# EAGLE design ioboard-left (EAGLE 9.6.2)
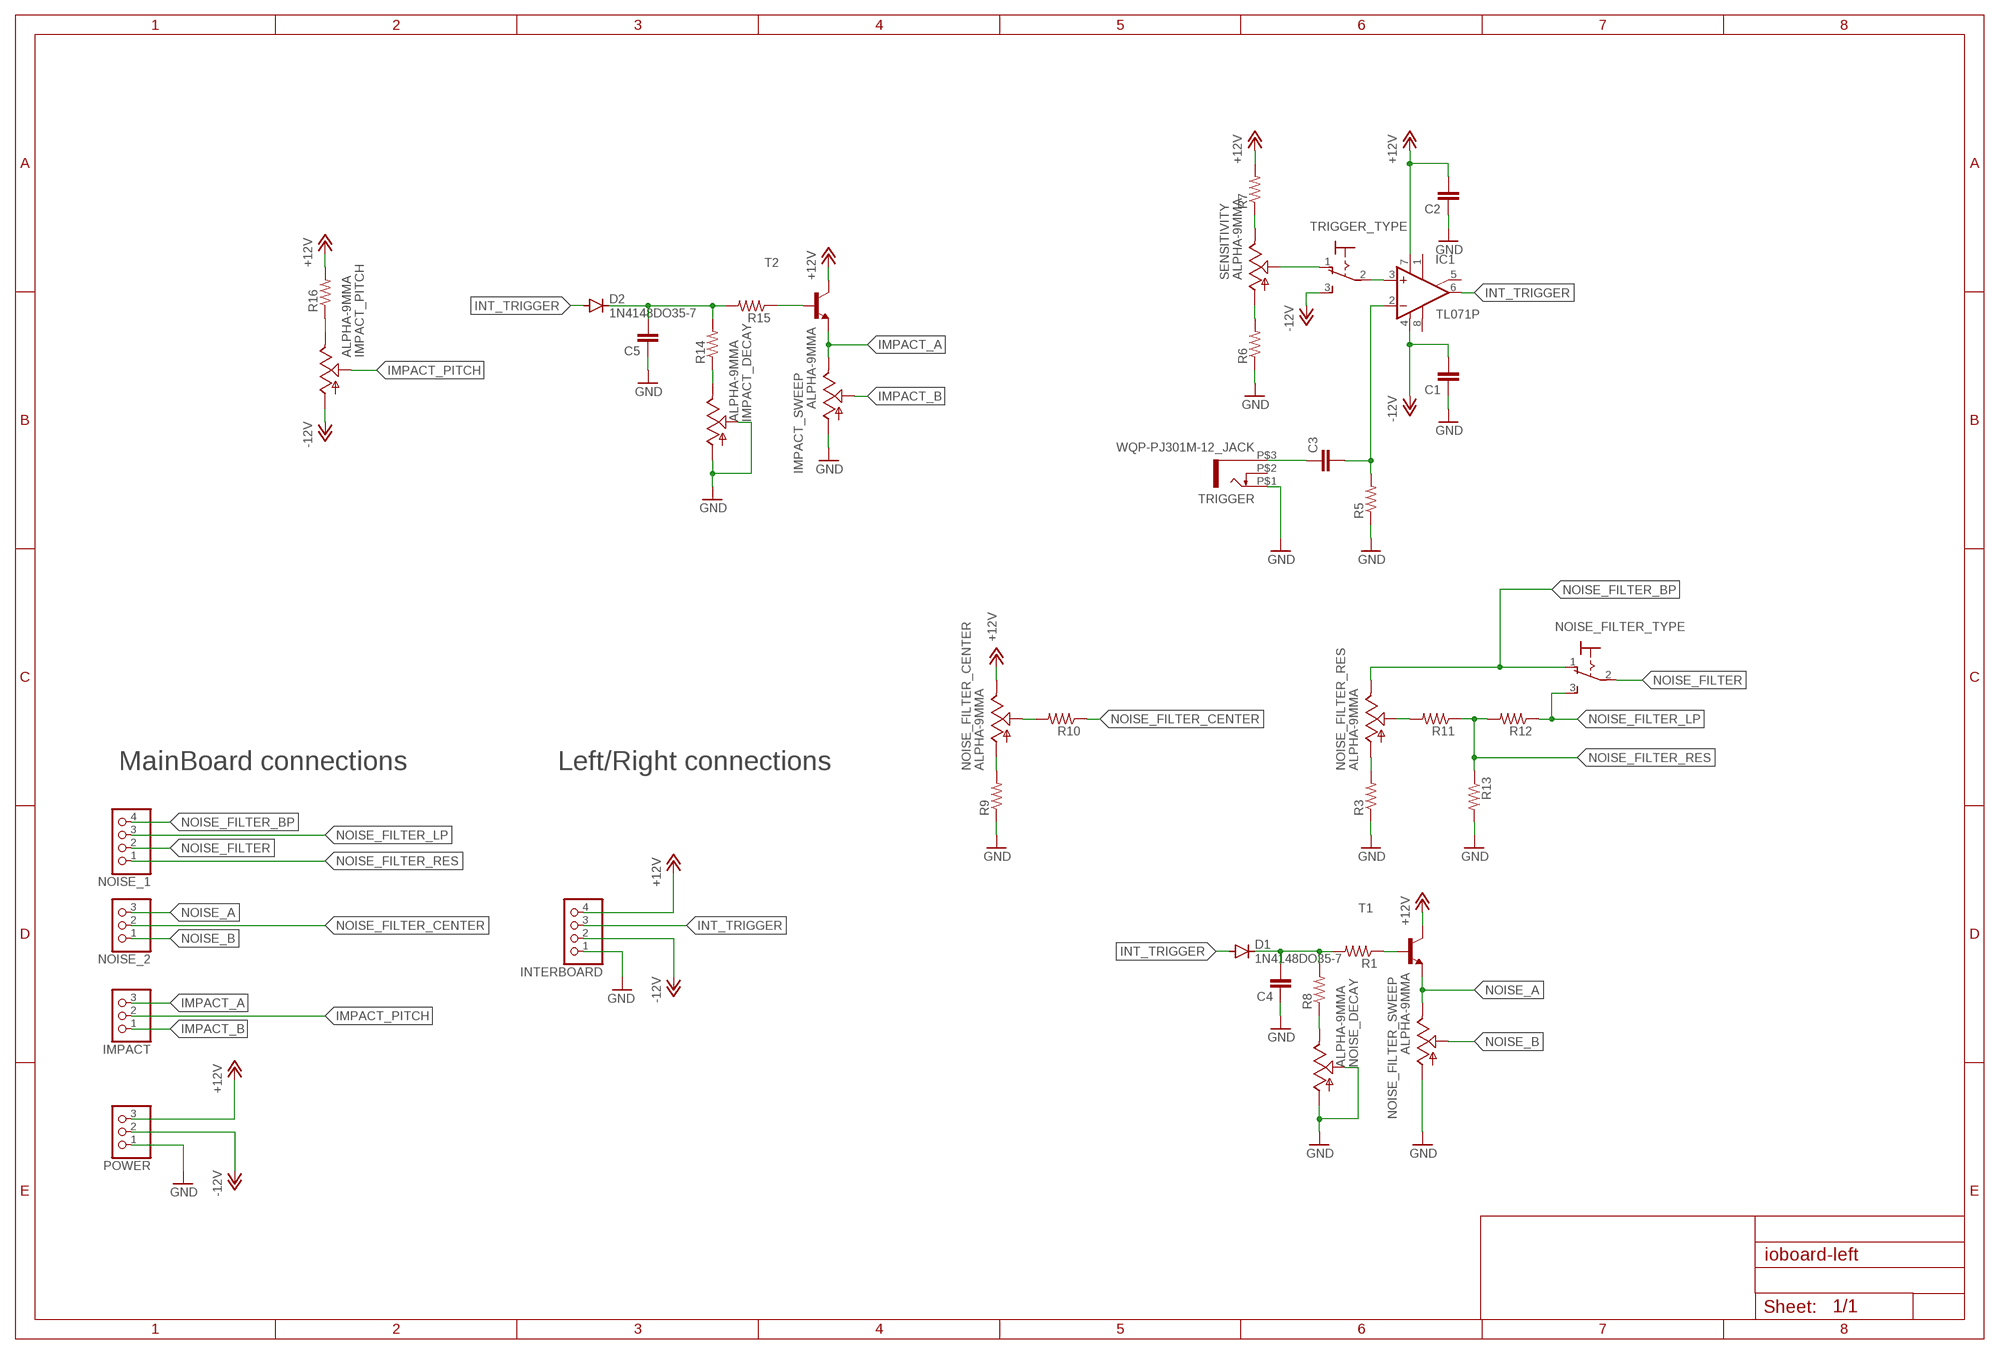
[diagram p0: schematic, sheet 1]

## Parts
C1  C-EU050-024X044  [C050-024X044]
C2  C-EU050-024X044  [C050-024X044]
C3  C-EU050-024X044  [C050-024X044]
C4  C-EU050-024X044  [C050-024X044]
C5  C-EU050-024X044  [C050-024X044]
D1  1N4148DO35-7  [DO35-7]
D2  1N4148DO35-7  [DO35-7]
IC1  TL071P  [DIL08]
IMPACT  PINHD-1X3  [1X03]
IMPACT_DECAY  ALPHA-9MMA  [EVUF]
IMPACT_PITCH  ALPHA-9MMA  [EVUF]
IMPACT_SWEEP  ALPHA-9MMA  [EVUF]
INTERBOARD  PINHD-1X4  [1X04]
NOISE_1  PINHD-1X4  [1X04]
NOISE_2  PINHD-1X3  [1X03]
NOISE_DECAY  ALPHA-9MMA  [EVUF]
NOISE_FILTER_CENTER  ALPHA-9MMA  [EVUF]
NOISE_FILTER_RES  ALPHA-9MMA  [EVUF]
NOISE_FILTER_SWEEP  ALPHA-9MMA  [EVUF]
NOISE_FILTER_TYPE  M9040P  [M9040P]
POWER  PINHD-1X3  [1X03]
R1  R-US_0207/7  [0207/7]
R3  R-US_0207/7  [0207/7]
R5  R-US_0207/7  [0207/7]
R6  R-US_0207/7  [0207/7]
R7  R-US_0207/7  [0207/7]
R8  R-US_0207/7  [0207/7]
R9  R-US_0207/7  [0207/7]
R10  R-US_0207/7  [0207/7]
R11  R-US_0207/7  [0207/7]
R12  R-US_0207/7  [0207/7]
R13  R-US_0207/7  [0207/7]
R14  R-US_0207/7  [0207/7]
R15  R-US_0207/7  [0207/7]
R16  R-US_0207/7  [0207/7]
SENSITIVITY  ALPHA-9MMA  [EVUF]
T1  2N3904-NPN-TO92-EBC  [TO92-EBC]
T2  2N3904-NPN-TO92-EBC  [TO92-EBC]
TRIGGER  WQP-PJ301M-12_JACK  [WQP-PJ301M-12_JACK]
TRIGGER_TYPE  M9040P  [M9040P]

## Nets
+12V: C2.2 IC1.7(V+) INTERBOARD.4 NOISE_FILTER_CENTER.3(E) POWER.3 R7.2 R16.2 T1.C T2.C
-12V: C1.2 IC1.4(V-) IMPACT_PITCH.1(A) INTERBOARD.2 POWER.2 TRIGGER_TYPE.3(S)
GND: C1.1 C2.1 C4.1 C5.1 IMPACT_DECAY.1(A) IMPACT_DECAY.2(S) IMPACT_SWEEP.1(A) INTERBOARD.1 NOISE_DECAY.1(A) NOISE_DECAY.2(S) NOISE_FILTER_SWEEP.1(A) POWER.1 R3.1 R5.1 R6.1 R9.1 R13.2 TRIGGER.P$1
IMPACT_A: IMPACT.3 IMPACT_SWEEP.3(E) T2.E
IMPACT_B: IMPACT.1 IMPACT_SWEEP.2(S)
IMPACT_PITCH: IMPACT.2 IMPACT_PITCH.2(S)
INT_TRIGGER: D1.A D2.A IC1.6(OUT) INTERBOARD.3
N$1: R7.1 SENSITIVITY.3(E)
N$2: R6.2 SENSITIVITY.1(A)
N$3: SENSITIVITY.2(S) TRIGGER_TYPE.1(O)
N$4: IC1.3(+IN) TRIGGER_TYPE.2(P)
N$5: C3.1 TRIGGER.P$3
N$6: C3.2 IC1.2(-IN) R5.2
N$8: C4.2 D1.C R1.2 R8.2
N$9: NOISE_DECAY.3(E) R8.1
N$10: R1.1 T1.B
N$13: NOISE_FILTER_CENTER.1(A) R9.2
N$14: NOISE_FILTER_CENTER.2(S) R10.2
N$15: NOISE_FILTER_RES.1(A) R3.2
N$16: NOISE_FILTER_RES.2(S) R11.2
N$17: C5.2 D2.C R14.2 R15.2
N$18: IMPACT_DECAY.3(E) R14.1
N$20: R15.1 T2.B
N$22: IMPACT_PITCH.3(E) R16.1
NOISE_A: NOISE_2.3 NOISE_FILTER_SWEEP.3(E) T1.E
NOISE_B: NOISE_2.1 NOISE_FILTER_SWEEP.2(S)
NOISE_FILTER: NOISE_1.2 NOISE_FILTER_TYPE.2(P)
NOISE_FILTER_BP: NOISE_1.4 NOISE_FILTER_RES.3(E) NOISE_FILTER_TYPE.1(O)
NOISE_FILTER_CENTER: NOISE_2.2 R10.1
NOISE_FILTER_LP: NOISE_1.3 NOISE_FILTER_TYPE.3(S) R12.1
NOISE_FILTER_RES: NOISE_1.1 R11.1 R12.2 R13.1
Unconnected: IC1.1(ON1) IC1.5(ON2) IC1.8(OPT) TRIGGER.P$2

## Notes on the sheet
- MainBoard connections | Left/Right connections

## Library data of the parts
C1-C5 = rcl:C-EU: CAPACITOR, European symbol; SPICEPREFIX: C
D1 D2 = diode:1N4148: DIODE high speed (Philips)
IC1 = linear:TL071: OP AMP
IMPACT NOISE_2 POWER = pinhead:PINHD-1X3: PIN HEADER
IMPACT_DECAY IMPACT_PITCH IMPACT_SWEEP NOISE_DECAY NOISE_FILTER_CENTER NOISE_FILTER_RES NOISE_FILTER_SWEEP SENSITIVITY = TomW:ALPHA-9MM: 9 mm Square Rotary Potentiometers Source: Panasonic
INTERBOARD NOISE_1 = pinhead:PINHD-1X4: PIN HEADER
NOISE_FILTER_TYPE TRIGGER_TYPE = switch:M9040P: TOGGLE SWITCH Marquardt
R1 R3 R5-R16 = rcl:R-US_: RESISTOR, American symbol; SPICEPREFIX: R
T1 T2 = transistor-neu-to92:*-NPN-: NPN Transistror
TRIGGER = thonkiconn:WQP-PJ301M-12_JACK

## Board
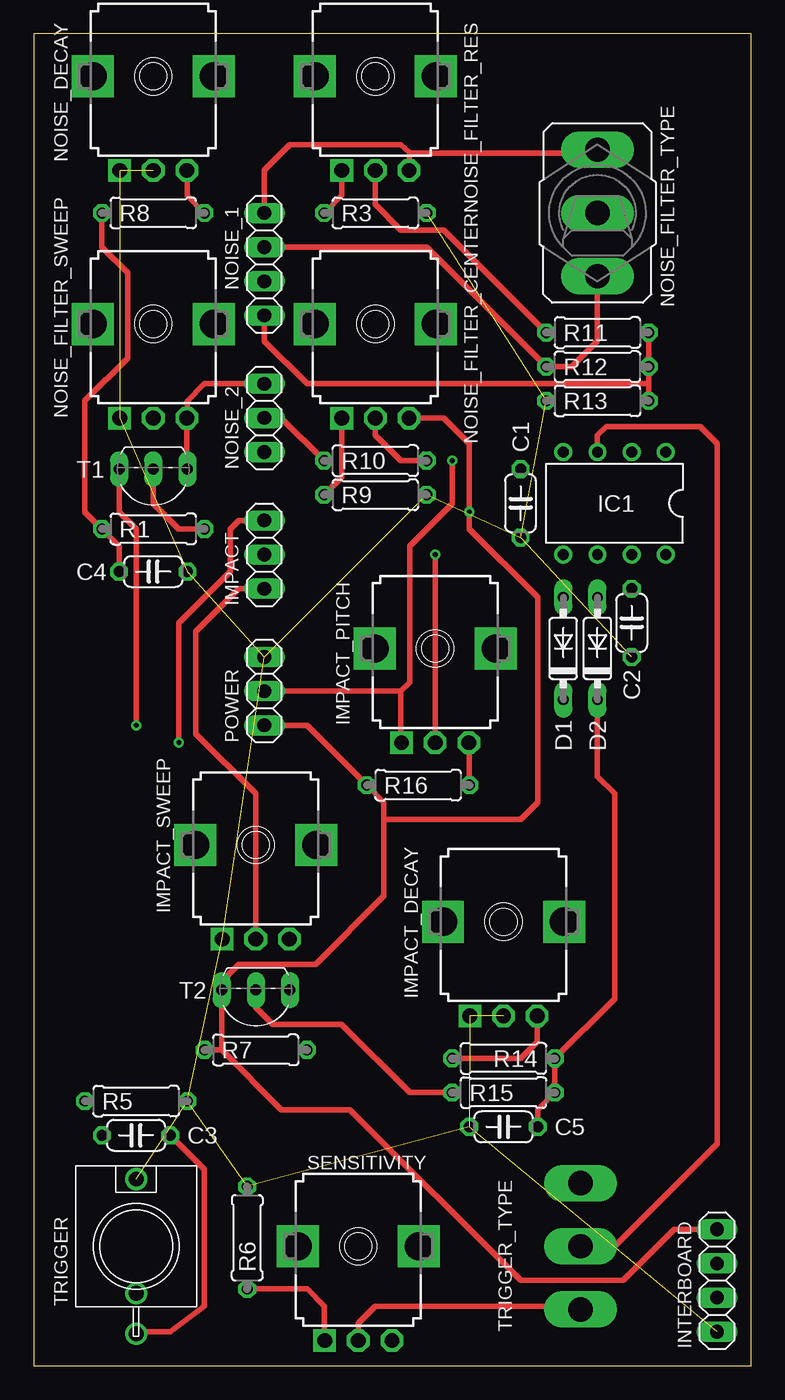
[diagram p1: board, top side]
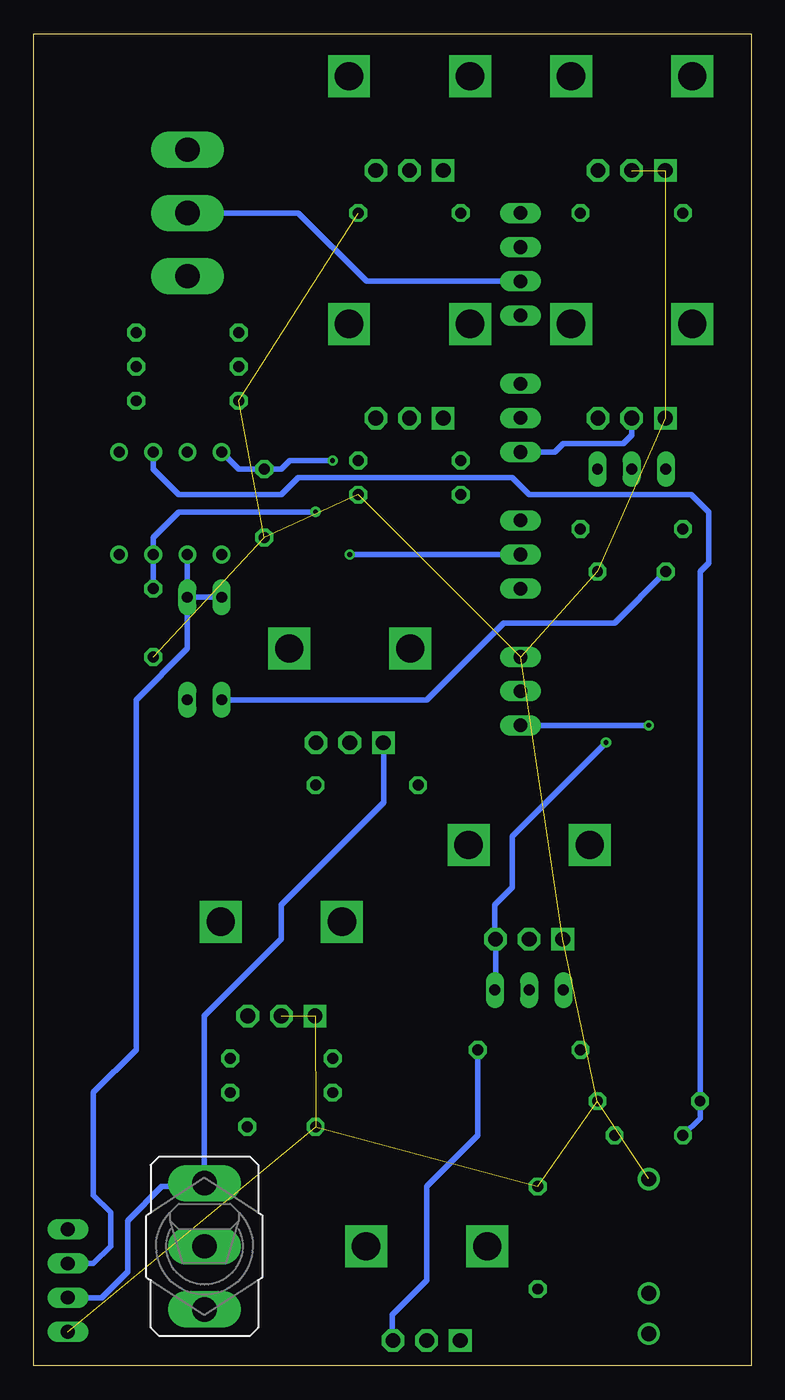
[diagram p2: board, bottom side, seen from below]

Size 53.34 x 99.06 mm. Coordinates in mm from the lower left corner, seen from the top.
Outline: 0,0 53.34,0 53.34,99.06 0,99.05 0,0
Copper layers (1*16): Top 0.035mm / dielectric 1.5mm / Bottom 0.035mm
Design rules "default": minimum track width 6mil, minimum drill 0.35mm, track to track 6mil, track to pad 6mil, pad to pad 6mil, via to via 6mil, smd to smd 6mil, copper to edge 40mil, drill to drill 6mil, minimum pad ring 10mil, minimum via ring 8mil, stop-mask expansion 4mil, vias tented up to drill 0mil, thermal gap 10mil

### Footprints (pad centres in the part's own frame; a part is rotated, then mirrored left to right if it is on the bottom)
C050-024X044 = drill 0.813 octagon: 1 -2.54,0; 2 2.54,0
DO35-7 = drill 0.813 long: A 3.81,0; C -3.81,0
DIL08 = drill 0.813 pad 1.27: 1 -3.81,-3.81; 2 -1.27,-3.81; 3 1.27,-3.81; 4 3.81,-3.81; 5 3.81,3.81; 6 1.27,3.81; 7 -1.27,3.81; 8 -3.81,3.81
1X03 = drill 1.016 long: 1 -2.54,0; 2 0,0; 3 2.54,0
EVUF = drill 1.1 pad 1.676 square: 1 -2.5,-7 | drill 1.1 pad 1.676 octagon: 2 0,-7; 3 2.5,-7 | drill 2.1 pad 2.8 square: M1 4.5,0; M2 -4.5,0
1X04 = drill 1.016 long: 1 -3.81,0; 2 -1.27,0; 3 1.27,0; 4 3.81,0
M9040P = drill 1.803 long: 1 0,4.699; 2 0,0; 3 0,-4.699
0207/7 = drill 0.813 octagon: 1 -3.81,0; 2 3.81,0
TO92-EBC = drill 0.813 long: B 0,-1.27; C 2.54,-1.27; E -2.54,-1.27
WQP-PJ301M-12_JACK = drill 1.1: P$1 0,5; P$2 0,-3.5; P$3 0,-6.5

### Placement (x,y rotation side)
C1  36.2,64.14 90 top
C2  44.45,55.24 90 top
C3  7.62,17.14 180 top
C4  8.89,59.05 180 top
C5  34.92,17.78 0 top
D1  39.37,53.34 90 top
D2  41.91,53.34 90 top
IC1  43.18,64.14 180 top
IMPACT  17.14,60.33 90 top
IMPACT_DECAY  34.92,33.02 0 top
IMPACT_PITCH  29.84,53.34 0 top
IMPACT_SWEEP  16.51,38.73 0 top
INTERBOARD  50.8,6.35 90 top
NOISE_1  17.14,81.92 90 top
NOISE_2  17.14,70.48 90 top
NOISE_DECAY  8.89,95.89 0 top
NOISE_FILTER_CENTER  25.4,77.47 0 top
NOISE_FILTER_RES  25.4,95.89 0 top
NOISE_FILTER_SWEEP  8.89,77.47 0 top
NOISE_FILTER_TYPE  41.91,85.72 0 top
POWER  17.14,50.16 270 top
R1  8.89,62.23 180 top
R3  25.4,85.72 180 top
R5  7.62,19.68 180 top
R6  15.88,9.53 270 top
R7  16.51,23.5 180 top
R8  8.89,85.72 180 top
R9  25.4,64.77 180 top
R10  25.4,67.31 0 top
R11  41.91,76.83 180 top
R12  41.91,74.3 0 top
R13  41.91,71.75 180 top
R14  34.92,22.86 0 top
R15  34.92,20.32 0 top
R16  28.57,43.18 180 top
SENSITIVITY  24.13,8.89 0 top
T1  8.89,65.41 180 top
T2  16.51,26.67 180 top
TRIGGER  7.62,8.89 0 top
TRIGGER_TYPE  40.64,8.89 180 bottom

### Tracks (layer width: path | path; a pad name or v marks a point on that pad's centre or on a via)
+12V  (via drill 0.35)
  Top 0.406: 13.97,23.5 T2.C 13.97,28.57 15.24,29.84 20.95,29.84 26.04,34.92 26.04,40.64 | POWER.3 20.32,47.62 R16.2 26.04,41.91 26.04,40.64 | T1.C 6.35,63.5 7.62,62.23 v7.62,47.62 | NOISE_FILTER_CENTER.3 27.91,70.48 30.48,70.48 32.38,68.58 v32.38,63.5 32.38,62.23 37.47,57.15 37.47,41.91 36.2,40.64 26.04,40.64 | INTERBOARD.4 47.62,10.16 43.81,6.35 36.2,6.35 23.5,19.05 18.41,19.05 13.97,23.5 | 13.97,23.5 R7.2
  Bottom 0.406: C2.2 IC1.7 44.45,61.59 42.55,63.5 v32.38,63.5 | v7.62,47.62 POWER.3
-12V  (via drill 0.35)
  Top 0.406: POWER.2 27.3,50.16 | 27.3,50.16 27.94,50.8 27.94,60.96 31.11,64.14 v31.11,67.31 | 27.3,50.16 27.3,46.38 IMPACT_PITCH.1
  Bottom 0.406: IC1.4 38.1,66.67 C1.2 34.92,66.67 34.29,67.31 v31.11,67.31 | INTERBOARD.2 48.26,5.08 46.35,6.99 46.35,10.79 43.81,13.34 40.89,13.34 TRIGGER_TYPE.3 40.64,26.04 34.92,31.75 34.92,34.29 27.3,41.91 27.3,46.38 IMPACT_PITCH.1
GND  (17 unrouted)
IMPACT_A  (via drill 0.35)
  Top 0.406: IMPACT.3 15.24,62.87 14.61,62.23 14.61,59.05 10.79,55.24 v10.79,46.35
  Bottom 0.406: v10.79,46.35 17.78,39.37 17.78,35.56 19.05,34.29 19.05,31.75 IMPACT_SWEEP.3 19.01,27.98 T2.E
IMPACT_B
  Top 0.406: IMPACT_SWEEP.2 16.51,42.55 12.06,46.99 12.06,54.61 15.24,57.78 IMPACT.1
IMPACT_PITCH  (via drill 0.35)
  Top 0.406: v29.84,60.33 IMPACT_PITCH.2
  Bottom 0.406: IMPACT.2 v29.84,60.33
INT_TRIGGER
  Bottom 0.406: D1.A D2.A | D2.A IC1.6 | D2.A 41.91,53.34 45.72,49.53 45.72,23.5 48.9,20.32 48.9,12.7 47.62,11.43 47.62,8.89 48.9,7.62 INTERBOARD.3
N$1
  Bottom 0.406: R7.1 20.32,17.14 24.13,13.34 24.13,6.35 26.67,3.81 26.67,1.93 SENSITIVITY.3
N$2
  Top 0.406: R6.2 20.32,5.71 21.59,4.45 21.59,1.91 SENSITIVITY.1
N$3
  Top 0.406: TRIGGER_TYPE.1 40.26,4.45 25.4,4.45 24.13,3.17 SENSITIVITY.2
N$4
  Top 0.406: TRIGGER_TYPE.2 43.18,8.89 50.8,16.51 50.8,68.58 49.53,69.85 42.55,69.85 41.91,69.22 IC1.3
N$5
  Top 0.406: TRIGGER.P$3 7.62,2.54 10.16,2.54 12.7,4.45 12.7,14.61 C3.1
N$6
  Bottom 0.406: C3.2 3.81,18.41 R5.2 3.81,59.05 3.17,59.69 3.17,63.5 4.45,64.77 16.51,64.77 17.78,66.04 33.66,66.04 34.92,64.77 42.55,64.77 44.45,66.67 IC1.2
N$8
  Top 0.406: R8.2 5.08,83.19 6.99,81.28 6.99,74.93 3.81,71.75 3.81,63.5 R1.2 6.35,60.96 C4.2
  Bottom 0.406: D1.C 24.13,49.53 18.41,55.24 10.16,55.24 C4.2
N$9
  Top 0.406: NOISE_DECAY.3 11.43,88.84 11.43,87 R8.1
N$10
  Top 0.406: R1.1 10.79,62.23 8.89,64.14 T1.B
N$13
  Top 0.406: NOISE_FILTER_CENTER.1 22.9,66.08 R9.2
N$14
  Top 0.406: NOISE_FILTER_CENTER.2 25.4,69.22 27.3,67.31 R10.2
N$15
  Top 0.406: NOISE_FILTER_RES.1 22.9,87.03 R3.2
N$16
  Top 0.406: NOISE_FILTER_RES.2 25.4,86.36 27.3,84.45 30.48,84.45 R11.2
N$17
  Top 0.406: C5.2 37.47,19.05 R15.2 R14.2 43.18,27.3 43.18,42.55 41.91,43.81 D2.C
N$18
  Top 0.406: R14.1 36.2,22.86 37.42,24.09 IMPACT_DECAY.3
N$20
  Top 0.406: R15.1 27.94,20.32 22.86,25.4 17.78,25.4 16.51,26.67 T2.B
N$22
  Top 0.406: IMPACT_PITCH.3 32.38,46.3 R16.1
NOISE_A
  Top 0.406: T1.E 11.39,66.72 NOISE_FILTER_SWEEP.3 11.41,71.74 12.7,73.03 NOISE_2.3
NOISE_B
  Bottom 0.406: NOISE_FILTER_SWEEP.2 8.89,69.22 9.53,68.58 13.97,68.58 14.61,67.94 NOISE_2.1
NOISE_FILTER
  Bottom 0.406: NOISE_1.2 28.57,80.64 33.66,85.72 NOISE_FILTER_TYPE.2
NOISE_FILTER_BP
  Top 0.406: NOISE_FILTER_TYPE.1 41.91,90.17 27.94,90.17 NOISE_FILTER_RES.3 27.94,90.19 27.3,90.81 19.05,90.81 17.14,88.9 NOISE_1.4
NOISE_FILTER_CENTER
  Top 0.406: NOISE_2.2 18.41,70.48 R10.1
NOISE_FILTER_LP
  Top 0.406: NOISE_FILTER_TYPE.3 41.91,76.2 40.01,74.3 R12.1 29.21,83.19 NOISE_1.3
NOISE_FILTER_RES
  Top 0.406: R11.1 R12.2 R13.1 45.72,73.03 20.32,73.03 17.14,76.2 NOISE_1.1